# Altium schematic sheet Connectors.SchDoc
size A4; SheetNumber: 6; SheetTotal: 6
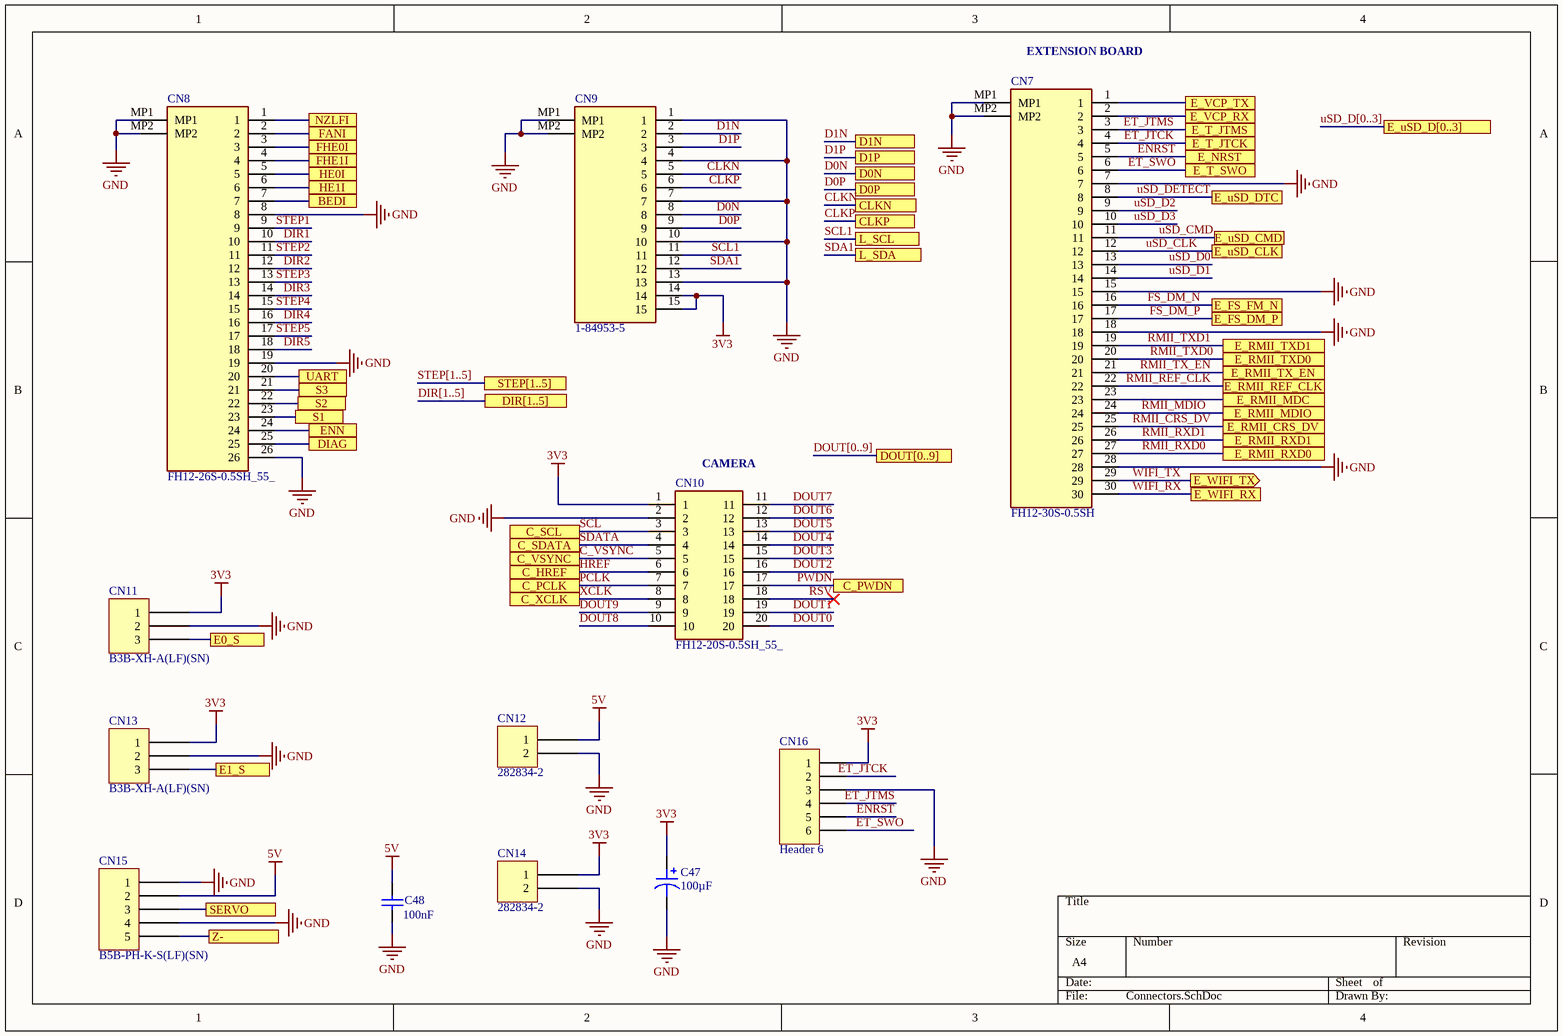
[diagram p0: Connectors.SchDoc]

## Parts
C47  100µF  [CAP ALSMD POLY 5.3MM H6.0MM]
C48  value 100nF  [1608[0603]]  (hidden comment: X5R)
CN7  FH12-30S-0.5SH  [FH1230S05SH]
CN8  FH12-26S-0.5SH_55_  [FH1226S05SH55]
CN9  1-84953-5  [1849535]
CN10  FH12-20S-0.5SH_55_  [FH12-20S-0.5SH(55)]
CN11  B3B-XH-A(LF)(SN)  [JST XH B3B-XH-A]
CN12  282834-2  [TE 282834-2]
CN13  B3B-XH-A(LF)(SN)  [JST XH B3B-XH-A]
CN14  282834-2  [TE 282834-2]
CN15  B5B-PH-K-S(LF)(SN)  [JST B5B-PH-K]
CN16  Header 6  [HDR1X6]

## Ports
BEDI (see Motherboard[3A], STM32F7[3A]), C_HREF (see Motherboard[3C], STM32F7[4A]), C_PCLK (see Motherboard[3C], STM32F7[4A]), C_PWDN (see Motherboard[3C], STM32F7[4A]), C_SCL (see Motherboard[3C], STM32F7[4A]), C_SDATA (see Motherboard[3C], STM32F7[4A]), C_VSYNC (see Motherboard[3C], STM32F7[4A]), C_XCLK (see Motherboard[3C], STM32F7[4A]), CLKN (see Motherboard[3B], STM32F7[3A]), CLKP (see Motherboard[3B], STM32F7[3A]), D0N (see Motherboard[3B], STM32F7[3A]), D0P (see Motherboard[3B], STM32F7[3A]), D1N (see Motherboard[3B], STM32F7[3A]), D1P (see Motherboard[3B], STM32F7[3A]), DIAG (see Motherboard[3A], STM32F7[3A]), DIR[1..5] (see Motherboard[3A], STM32F7[2A]), DOUT[0..9] (see Motherboard[3C], STM32F7[4A]), E0_S (see Motherboard[3C], STM32F7[4A]), E1_S (see Motherboard[3C], STM32F7[4A]), E_FS_DM_P (see Motherboard[3C], STM32F7[2A]), E_FS_FM_N (see Motherboard[3C], STM32F7[2A]), E_NRST (see Motherboard[3B], STM32F7[1A]), E_RMII_CRS_DV (see Motherboard[3C], STM32F7[3A]), E_RMII_MDC (see Motherboard[3C], STM32F7[3A]), E_RMII_MDIO (see Motherboard[3C], STM32F7[3A]), E_RMII_REF_CLK (see Motherboard[3C], STM32F7[3A]), E_RMII_RXD0 (see Motherboard[3C], STM32F7[3A]), E_RMII_RXD1 (see Motherboard[3C], STM32F7[3A]), E_RMII_TX_EN (see Motherboard[3C], STM32F7[3A]), E_RMII_TXD0 (see Motherboard[3C], STM32F7[3A]), E_RMII_TXD1 (see Motherboard[3C], STM32F7[3A]), E_T_JTCK (see Motherboard[3B], STM32F7[2A]), E_T_JTMS (see Motherboard[3B], STM32F7[2A]), E_T_SWO (see Motherboard[3B], STM32F7[1A]), E_uSD_CLK (see Motherboard[3C], STM32F7[3A]), E_uSD_CMD (see Motherboard[3C], STM32F7[3A]), E_uSD_D[0..3] (see Motherboard[3C], STM32F7[1A]), E_uSD_DTC (see Motherboard[3C], STM32F7[1A]), E_VCP_RX (see Motherboard[3B], STM32F7[2A]), E_VCP_TX (see Motherboard[3B], STM32F7[2A]), E_WIFI_RX (see Motherboard[3C], STM32F7[3A]), E_WIFI_TX (out, see Motherboard[3B], STM32F7[3A]), ENN (see Motherboard[3A], STM32F7[3A]), FANI (see Motherboard[3B], STM32F7[3A]), FHE0I (see Motherboard[3A], STM32F7[3A]), FHE1I (see Motherboard[3A], STM32F7[3A]), HE0I (see Motherboard[3A], STM32F7[3A]), HE1I (see Motherboard[3A], STM32F7[3A]), L_SCL (see Motherboard[3B], STM32F7[3A]), L_SDA (see Motherboard[3B], STM32F7[3A]), NZLFI (see Motherboard[3B], STM32F7[3A]), S1 (see Motherboard[3A], STM32F7[3A]), S2 (see Motherboard[3A], STM32F7[3A]), S3 (see Motherboard[3A], STM32F7[3A]), SERVO (see Motherboard[3C], STM32F7[4A]), STEP[1..5] (see Motherboard[3A], STM32F7[2A]), UART (see Motherboard[3A], STM32F7[3A]), Z- (see Motherboard[3C], STM32F7[4A])

## Nets
3V3: C47.1 CN9.14 CN9.15 CN10.1 CN11.1 CN13.1 CN14.1 CN16.1
5V: C48.1 CN12.1 CN15.2
GND: C47.2 C48.2 CN7.7 CN7.15 CN7.18 CN7.28 CN7.MP1 CN7.MP2 CN8.8 CN8.19 CN8.26 CN8.MP1 CN8.MP2 CN9.1 CN9.4 CN9.7 CN9.10 CN9.13 CN9.MP1 CN9.MP2 CN10.2 CN11.2 CN12.2 CN13.2 CN14.2 CN15.1 CN15.4 CN16.3
BEDI: CN8.7 ; port BEDI
C_VSYNC: CN10.5 ; port C_VSYNC
CLKN: CN9.5 ; port CLKN
CLKP: CN9.6 ; port CLKP
D0N: CN9.8 ; port D0N
D0P: CN9.9 ; port D0P
D1N: CN9.2 ; port D1N
D1P: CN9.3 ; port D1P
DIAG: CN8.25 ; port DIAG
DIR1: CN8.10
DIR2: CN8.12
DIR3: CN8.14
DIR4: CN8.16
DIR5: CN8.18
DOUT0: CN10.20
DOUT1: CN10.19
DOUT2: CN10.16
DOUT3: CN10.15
DOUT4: CN10.14
DOUT5: CN10.13
DOUT6: CN10.12
DOUT7: CN10.11
DOUT8: CN10.10
DOUT9: CN10.9
E0_S: CN11.3 ; port E0_S
E1_S: CN13.3 ; port E1_S
E_RMII_MDC: CN7.23 ; port E_RMII_MDC
E_VCP_RX: CN7.2 ; port E_VCP_RX
E_VCP_TX: CN7.1 ; port E_VCP_TX
ENN: CN8.24 ; port ENN
ENRST: CN7.5 CN16.5 ; port E_NRST
ET_JTCK: CN7.4 CN16.2 ; port E_T_JTCK
ET_JTMS: CN7.3 CN16.4 ; port E_T_JTMS
ET_SWO: CN7.6 CN16.6 ; port E_T_SWO
FANI: CN8.2 ; port FANI
FHE0I: CN8.3 ; port FHE0I
FHE1I: CN8.4 ; port FHE1I
FS_DM_N: CN7.16 ; port E_FS_FM_N
FS_DM_P: CN7.17 ; port E_FS_DM_P
HE0I: CN8.5 ; port HE0I
HE1I: CN8.6 ; port HE1I
HREF: CN10.6 ; port C_HREF
NZLFI: CN8.1 ; port NZLFI
PCLK: CN10.7 ; port C_PCLK
PWDN: CN10.17 ; port C_PWDN
RMII_CRS_DV: CN7.25 ; port E_RMII_CRS_DV
RMII_MDIO: CN7.24 ; port E_RMII_MDIO
RMII_REF_CLK: CN7.22 ; port E_RMII_REF_CLK
RMII_RXD0: CN7.27 ; port E_RMII_RXD0
RMII_RXD1: CN7.26 ; port E_RMII_RXD1
RMII_TX_EN: CN7.21 ; port E_RMII_TX_EN
RMII_TXD0: CN7.20 ; port E_RMII_TXD0
RMII_TXD1: CN7.19 ; port E_RMII_TXD1
RSV: CN10.18
S1: CN8.23 ; port S1
S2: CN8.22 ; port S2
S3: CN8.21 ; port S3
SCL: CN10.3 ; port C_SCL
SCL1: CN9.11 ; port L_SCL
SDA1: CN9.12 ; port L_SDA
SDATA: CN10.4 ; port C_SDATA
SERVO: CN15.3 ; port SERVO
STEP1: CN8.9
STEP2: CN8.11
STEP3: CN8.13
STEP4: CN8.15
STEP5: CN8.17
UART: CN8.20 ; port UART
uSD_CLK: CN7.12 ; port E_uSD_CLK
uSD_CMD: CN7.11 ; port E_uSD_CMD
uSD_D0: CN7.13
uSD_D1: CN7.14
uSD_D2: CN7.9
uSD_D3: CN7.10
uSD_DETECT: CN7.8 ; port E_uSD_DTC
WIFI_RX: CN7.30 ; port E_WIFI_RX
WIFI_TX: CN7.29 ; port E_WIFI_TX
XCLK: CN10.8 ; port C_XCLK
Z-: CN15.5 ; port Z-

## Buses and harness runs
bus DIR[1..5] = port DIR[1..5]
bus DOUT[0..9] = port DOUT[0..9]
bus STEP[1..5] = port STEP[1..5]
bus uSD_D[0..3] = port E_uSD_D[0..3]

## Notes on the sheet
- (near CN7) EXTENSION BOARD
- (near CN10) CAMERA

## Library data of the parts
C47 = 6SVPC100M: CAP ALUM POLY 100UF 20% 6.3V SMD; manufacturer: Panasonic Electronic Components; ESR (Equivalent Series Resistance): 30mOhm; Lifetime @ Temp.: 2000 Hrs @ 105°C; Ripple Current @ High Frequency: 2.15A @ 100kHz; Ripple Current @ Low Frequency: 107.5mA @ 120Hz; Surface Mount Land Size: 0.209" L x 0.209" W (5.30mm x 5.30mm); Type: Polymer; Part Number: 6SVPC100M; Applications: General Purpose; Capacitance: 100µF; componentlink1description: Datasheet; componentlink1url: https://industrial.panasonic.com/cdbs/www-data/pdf/AAB8000/AAB8000C256.pdf; componentlink2description: DigiKey Link; componentlink2url: http://digikey.com/product-detail/en/panasonic-electronic-components/6SVPC100M/P16606CT-ND/4204442; Device Package: Radial, Can - SMD; Height - Seated (Max): 0.236" (6.00mm); lastupdated: 9/2/2020 1:22:07 AM; Lifecycle Status: Active; Minimum Order: 1; Mounting Type: Surface Mount; Operating Temperature: -55°C ~ 105°C; Package / Case: Radial, Can - SMD; packaging: TapeAndReel; partid: 1943; Part Status: Active; price: 0.51; series: OS-CON™, SVPC; Size / Dimension: 0.197" Dia (5.00mm); Supplier 1: DigiKey; Supplier Part Number 1: P16606CT-ND; Tolerance: ±20%; value: 100µF; Voltage - Rated: 6.3V
C48 = Cap: Capacitor; Published: 8-Jun-2000; LatestRevisionDate: 17-Jul-2002; LatestRevisionNote: Re-released for DXP Platform.; PackageReference: RAD-0.3; Publisher: Altium Limited; PackageDescription: Radial Cap, Thru-Hole; 2 Leads; 0.3 in Pin Spacing
CN7 = FH12-30S-0.5SH: Connector; Manufacturer_Name: Hirose; Datasheet Link: https://datasheet.datasheetarchive.com/originals/dk/DKDS-2/23451.pdf; Height: 4.8mm; Manufacturer_Part_Number: FH12-30S-0.5SH
CN8 = FH12-26S-0.5SH_55_: Connector; Manufacturer_Name: Hirose; Manufacturer_Part_Number: FH12-26S-0.5SH(55); Datasheet Link: https://datasheet.datasheetarchive.com/originals/distributors/SFDatasheet-1/sf-00023459.pdf; Height: 2.2mm; Mouser Part Number: 798-FH12-26S-0.5SH55; Mouser Price/Stock: https://www.mouser.co.uk/ProductDetail/Hirose-Connector/FH12-26S-0.5SH55?qs=Ux3WWAnHpjC%2FipJJsmJDaQ%3D%3D; Arrow Part Number: FH12-26S-0.5SH(55); Arrow Price/Stock: https://www.arrow.com/en/products/fh12-26s-0.5sh-55/hirose-electric
CN9 = 1-84953-5: Connector; Manufacturer_Name: TE Connectivity; Datasheet Link: https://www.te.com/commerce/DocumentDelivery/DDEController?Action=showdoc&DocId=Customer+Drawing%7F84953%7FA3%7Fpdf%7FEnglish%7FENG_CD_84953_A3.pdf%7F1-84953-5; Height: 2.74mm; Manufacturer_Part_Number: 1-84953-5; Mouser Part Number: 571-1-84953-5; Mouser Price/Stock: https://www.mouser.co.uk/ProductDetail/TE-Connectivity/1-84953-5?qs=uUkeXfjQ8uS9OOvsO8VIHg%3D%3D; Arrow Part Number: 1-84953-5; Arrow Price/Stock: https://www.arrow.com/en/products/1-84953-5/te-connectivity?region=nac
CN10 = FH12-20S-0.5SH_55_: Connector; Manufacturer_Name: Hirose; Datasheet Link: https://componentsearchengine.com/Datasheets/2/FH12-20S-0.5SH(55).pdf; Manufacturer_Part_Number: FH12-20S-0.5SH(55); Mouser Part Number: 798-FH12-20S-0.5SH55; Mouser Price/Stock: https://www.mouser.co.uk/ProductDetail/Hirose-Connector/FH12-20S-0.5SH55?qs=Ux3WWAnHpjBAoMH%252Bjl1N9Q%3D%3D
CN11 CN13 = B3B-XH-A(LF)(SN): CONN HEADER VERT 3POS 2.5MM; Manufacturer: JST Sales America Inc.; Contact Length - Post: 0.134" (3.40mm); Current Rating (Amps): 3A; Material Flammability Rating: UL94 V-0; Number of Positions: 3; Number of Positions Loaded: All; Pitch - Mating: 0.098" (2.50mm); Shrouding: Shrouded - 4 Wall; Style: Board to Cable/Wire; Voltage Rating: 250V; Part Number: B3B-XH-A(LF)(SN); ComponentLink1Description: Datasheet; ComponentLink1URL: http://www.jst-mfg.com/product/pdf/eng/eXH.pdf; ComponentLink2Description: DigiKey Link; ComponentLink2URL: http://digikey.com/product-detail/en/jst-sales-america-inc/B3B-XH-A-LF-SN/455-2248-ND/1651046; Connector Type: Header; Contact Finish - Mating: Tin; Contact Finish - Post: Tin; Contact Material: Brass; Contact Shape: Square; Contact Type: Male Pin; Fastening Type: Detent Lock; Insulation Color: Natural; Insulation Height: 0.276" (7.00mm); Insulation Material: Polyamide (PA66), Nylon 6/6; LastUpdated: 1/12/2020 11:46:22 PM; Lifecycle Status: Active; Minimum Order: 1; Mounting Type: Through Hole; Number of Rows: 1; Operating Temperature: -25°C ~ 85°C; Packaging: Bulk; PartId: 68; Part Status: Active; Price: 0.19; Series: XH; Supplier 1: DigiKey; Supplier Part Number 1: 455-2248-ND; Termination: Press-Fit, Solder
CN12 CN14 = 282834-2: TERM BLK 2P SIDE ENT 2.54MM PCB; Manufacturer: TE Connectivity AMP Connectors; Current: 10A; Mating Orientation: Horizontal with Board; Number of Levels: 1; Pitch: 0.100" (2.54mm); Positions Per Level: 2; Voltage: 150V; Wire Gauge: 16-30 AWG; Wire Termination: Screw - Rising Cage Clamp; Part Number: 282834-2; Color: Green; ComponentLink1Description: Datasheet; ComponentLink1URL: https://www.te.com/commerce/DocumentDelivery/DDEController?Action=srchrtrv&DocNm=282834&DocType=Customer+Drawing&DocLang=English; ComponentLink2Description: DigiKey Link; ComponentLink2URL: http://digikey.com/product-detail/en/te-connectivity-amp-connectors/282834-2/A98333-ND/1150135; LastUpdated: 1/15/2020 4:15:38 AM; Lifecycle Status: Active; Minimum Order: 1; Mounting Type: Through Hole; Packaging: Bulk; Part Status: Active; Price: 0.88; Series: Buchanan; Supplier 1: DigiKey; Supplier Part Number 1: A98333-ND
CN15 = B5B-PH-K-S(LF)(SN): CONN HEADER VERT 5POS 2MM; Manufacturer: JST Sales America Inc.; Contact Length - Mating: 0.130" (3.30mm); Contact Length - Post: 0.134" (3.40mm); Current Rating (Amps): 2A; Material Flammability Rating: UL94 V-0; Number of Positions: 5; Number of Positions Loaded: All; Overall Contact Length: 0.333" (8.45mm); Pitch - Mating: 0.079" (2.00mm); Shrouding: Shrouded - 4 Wall; Style: Board to Cable/Wire; Voltage Rating: 100V; Part Number: B5B-PH-K-S(LF)(SN); ComponentLink1Description: Datasheet; ComponentLink1URL: http://www.jst-mfg.com/product/pdf/eng/ePH.pdf; ComponentLink2Description: DigiKey Link; ComponentLink2URL: http://digikey.com/product-detail/en/jst-sales-america-inc/B5B-PH-K-S-LF-SN/455-1707-ND/926614; Connector Type: Header; Contact Finish - Mating: Tin; Contact Finish - Post: Tin; Contact Material: Brass; Contact Shape: Square; Contact Type: Male Pin; Fastening Type: Detent Lock; Insulation Color: Natural; Insulation Height: 0.236" (6.00mm); Insulation Material: Polyamide (PA66), Nylon 6/6; LastUpdated: 1/12/2020 10:30:05 PM; Lifecycle Status: Active; Minimum Order: 1; Mounting Type: Through Hole; Number of Rows: 1; Operating Temperature: -25°C ~ 85°C; Packaging: Bulk; PartId: 28; Part Status: Active; Price: 0.29; Series: PH; Supplier 1: DigiKey; Supplier Part Number 1: 455-1707-ND; Termination: Press-Fit, Solder
CN16 = Header 6: Header, 6-Pin; LatestRevisionDate: 17-Jul-2002; LatestRevisionNote: Re-released for DXP Platform.; Publisher: Altium Limited